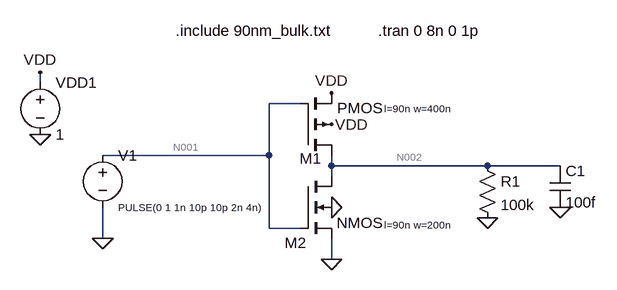
[diagram p0: schematic test.asc]
test.asc, the LTspice schematic file:
Version 4
SHEET 1 880 680
WIRE -320 96 -320 80
WIRE 80 128 32 128
WIRE 32 208 32 128
WIRE 32 208 -224 208
WIRE 128 224 128 208
WIRE 368 224 128 224
WIRE 480 224 368 224
WIRE 128 240 128 224
WIRE 32 320 32 208
WIRE 80 320 32 320
WIRE -224 336 -224 288
WIRE 128 368 128 336
FLAG -224 336 0
FLAG 128 368 0
FLAG 128 288 0
FLAG -320 176 0
FLAG -320 80 VDD
FLAG 128 112 VDD
FLAG 128 160 VDD
FLAG 368 304 0
FLAG 480 288 0
SYMBOL pmos4 80 208 M180
WINDOW 0 -1 -5 Left 2
WINDOW 3 57 73 Left 2
WINDOW 123 129 72 Left 1
SYMATTR InstName M1
SYMATTR Value2 l=90n w=400n
SYMBOL nmos4 80 240 R0
WINDOW 0 -24 103 Left 2
WINDOW 123 129 75 Left 1
SYMATTR InstName M2
SYMATTR Value2 l=90n w=200n
SYMBOL voltage -224 192 R0
WINDOW 3 24 96 Left 1
WINDOW 123 0 0 Left 0
WINDOW 39 0 0 Left 0
SYMATTR InstName V1
SYMATTR Value PULSE(0 1 1n 10p 10p 2n 4n)
SYMBOL voltage -320 80 R0
WINDOW 123 0 0 Left 0
WINDOW 39 0 0 Left 0
SYMATTR InstName VDD1
SYMATTR Value 1
SYMBOL res 352 208 R0
SYMATTR InstName R1
SYMATTR Value 100k
SYMBOL cap 464 224 R0
SYMATTR InstName C1
SYMATTR Value 100f
TEXT -112 16 Left 2 !.include 90nm_bulk.txt
TEXT 200 16 Left 2 !.tran 0 8n 0 1p

The netlist it stands for:
* test.asc
M1 N002 N001 VDD VDD PMOS l=90n w=400n
M2 N002 N001 0 0 NMOS l=90n w=200n
V1 N001 0 PULSE(0 1 1n 10p 10p 2n 4n)
VDD1 VDD 0 1
R1 N002 0 100k
C1 N002 0 100f
.model NMOS NMOS
.model PMOS PMOS
.lib standard.mos
.include 90nm_bulk.txt
.tran 0 8n 0 1p
.backanno
.end

* Results of the author's LTspice run, read from the files saved beside the schematic
* Operating Point, zero values left out:
*   V(n002) = 972.5 mV
*   V(vdd) = 1 V
*   Id(M1) = -9.73 µA
*   Ig(M1) = -2.738 pA
*   Is(M1) = 9.73 µA
*   Id(M2) = 4.875 nA
*   Ig(M2) = -107.7 pA
*   Is(M2) = -4.766 nA
*   I(R1) = 9.725 µA
*   I(V1) = 110.4 pA
*   I(Vdd1) = -9.73 µA
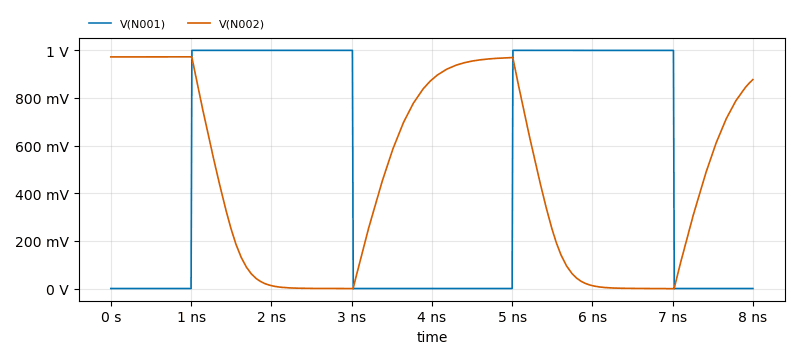
[diagram p1: Transient Analysis of test.asc, plotted from the saved traces]
* Transient Analysis, 1 run:
*   V(N001): min 0 V, max 1 V, average 502.5 mV, rms 708.3 mV, last 0 V
*   V(N002): min -1.184 mV, max 974 mV, average 455.6 mV, rms 607.4 mV, last 877.4 mV